# EasyEDA schematic SCH_EEPROM-Breakout-Board_2026-05-17.json
TITLE: EEPROM Breakout board; REV: 1.0; Date: 2025-09-20; Sheet: 1/1; Drawn By: srivatsarupadhya; Company: Your Company
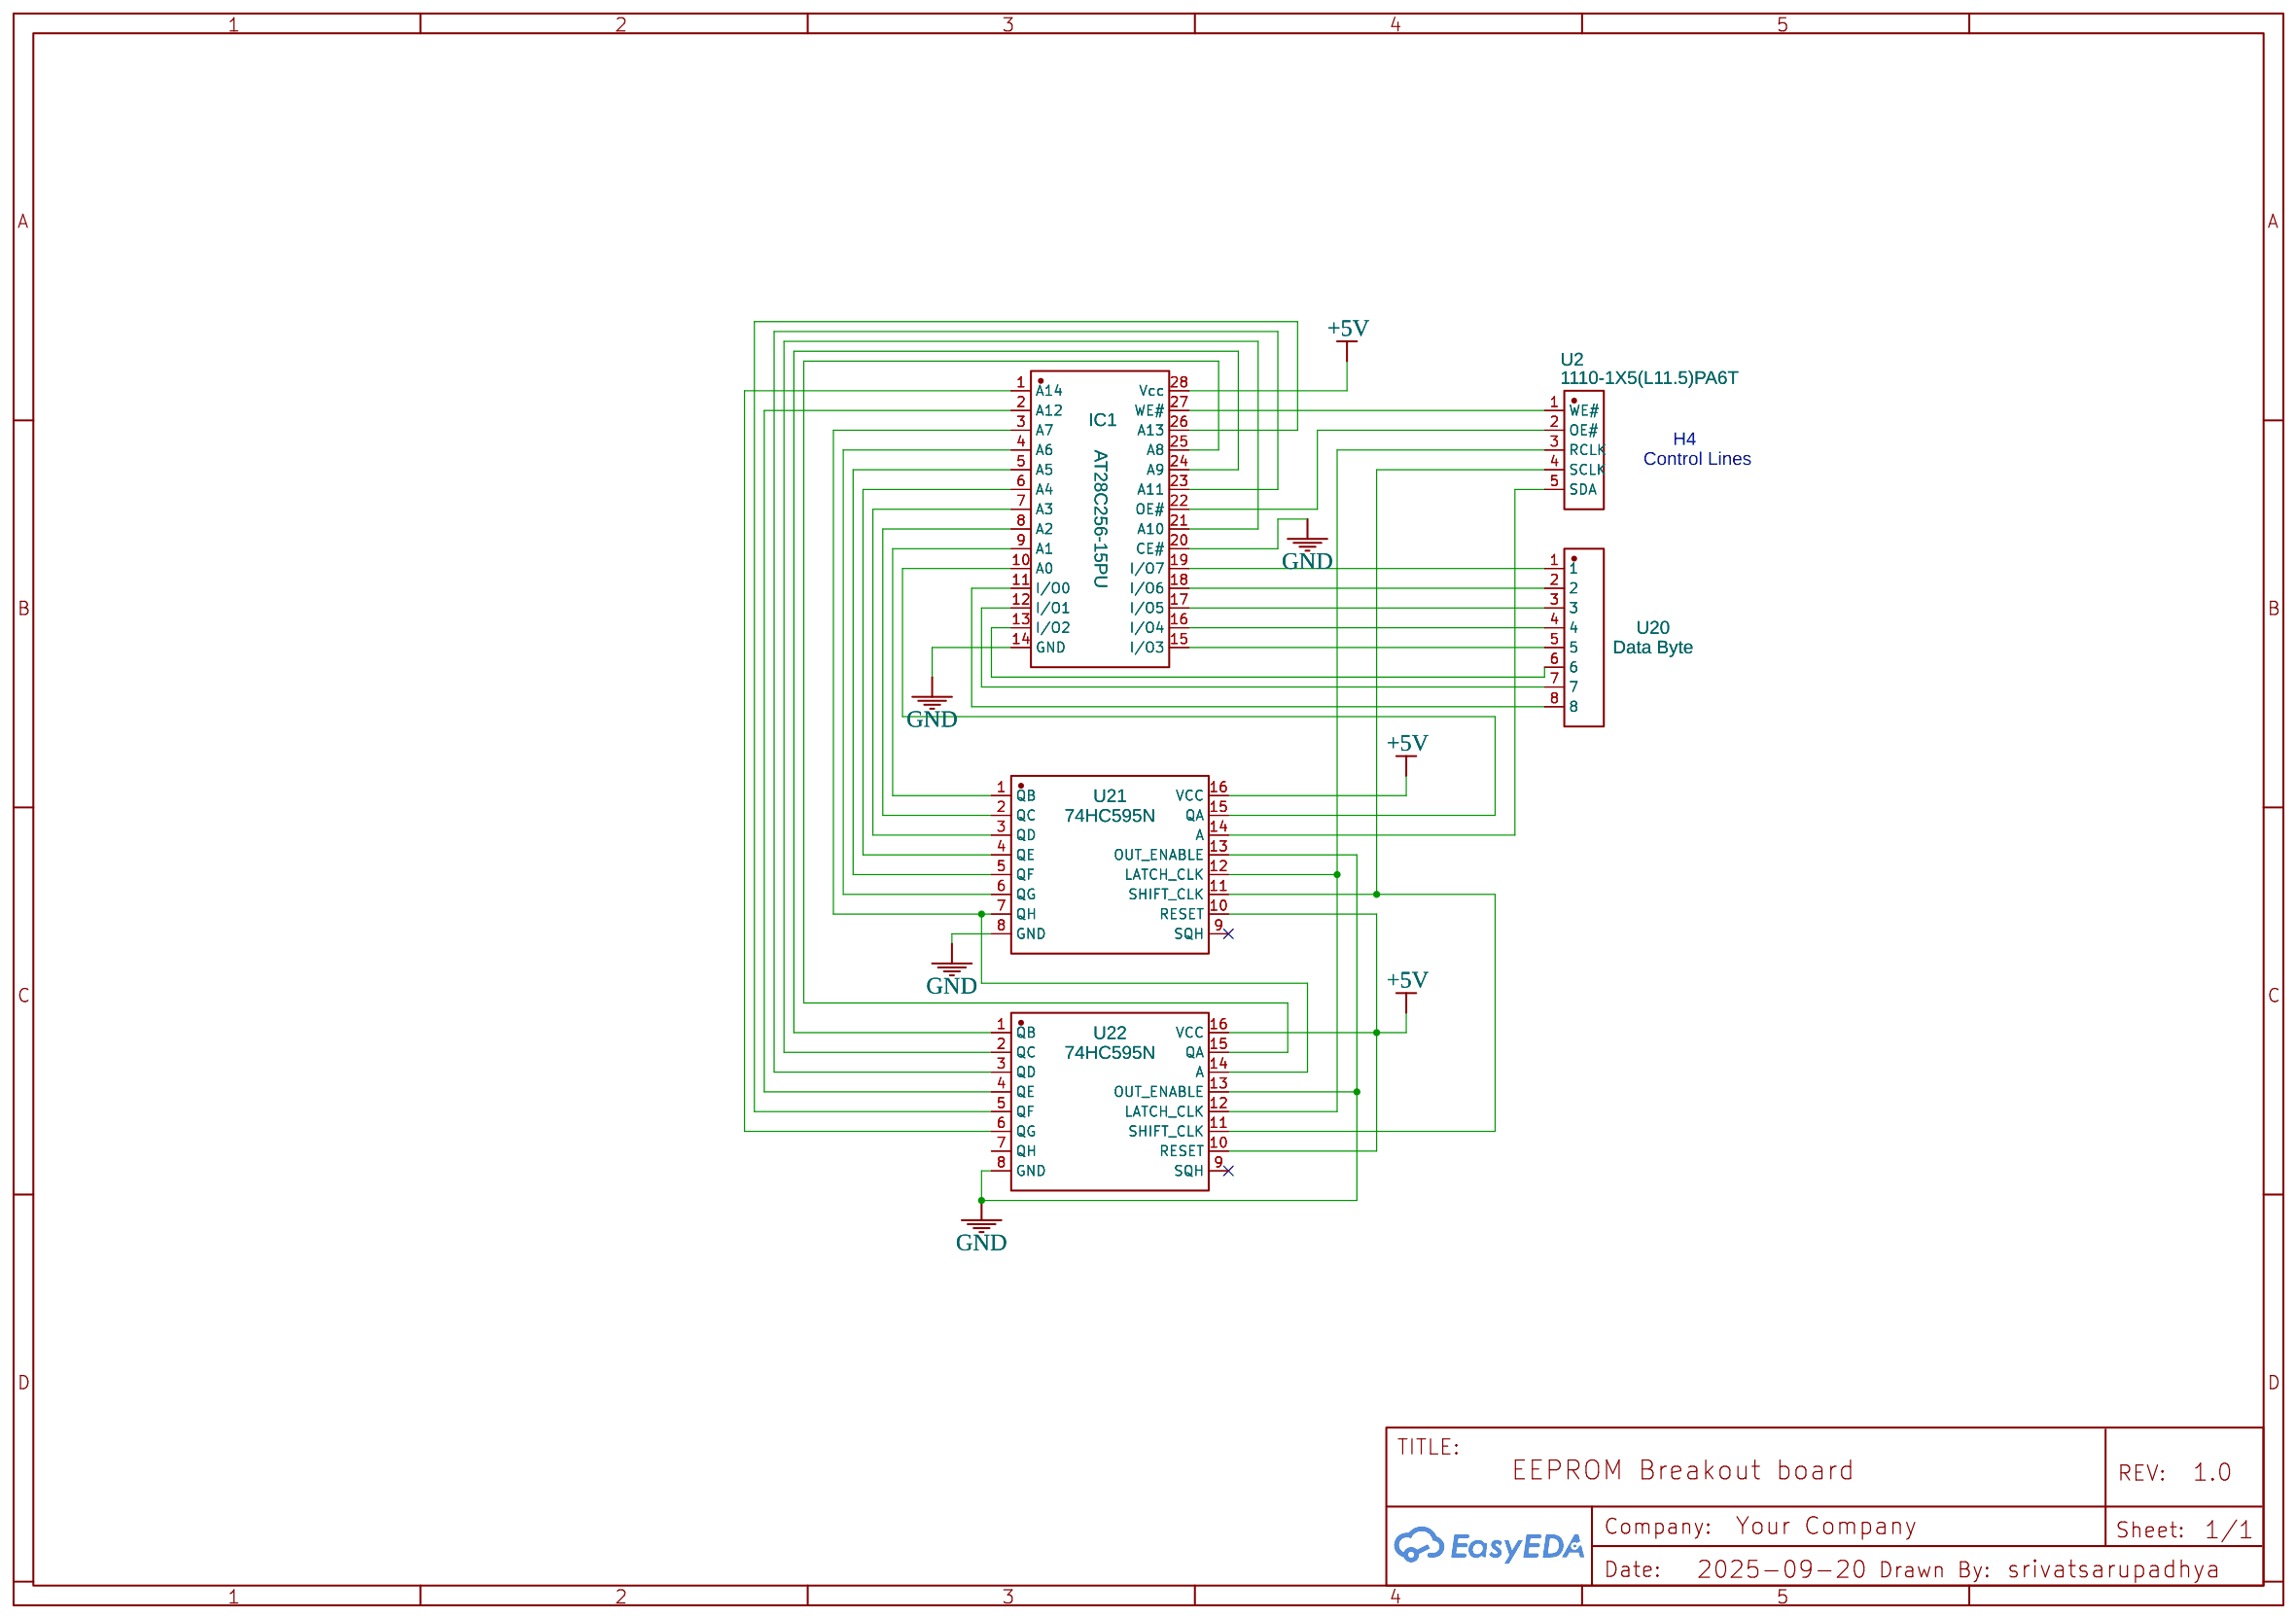
[diagram p0: schematic sheet]

## Parts
IC1  AT28C256-15PU  [PDIP-28_L37.0-W13.5-P2.54-LS15.6-BL]
U2  1110-1X5(L11.5)PA6T  [HDR-TH_5P-P2.54-H-M-W8.0]
U20  Data Byte  [HDR-TH_8P-P2.54-V-M]
U21  74HC595N  [DIP-16_L19.8-W6.5-P2.54-LS7.6-BL]
U22  74HC595N  [DIP-16_L19.8-W6.5-P2.54-LS7.6-BL]

## Library data of the parts
IC1 = AT28C256-15PU: Contributor: LCSC; Supplier: LCSC; Supplier Part: C1348752; Manufacturer: MICROCHIP(美国微芯); JLCPCB Part Class: Extended Part
U2 = 1110-1X5(L11.5)PA6T: Supplier: LCSC; Supplier Part: C18214185; Manufacturer: CST(永丰盈); Manufacturer Part: 1110-1x5(L11.5)PA6T; Contributor: lcsc; JLCPCB Part Class: Extended Part
U20 = 2.54-1*8: Supplier: LCSC; Supplier Part: C5156616; Manufacturer: ZHOURI(洲日); JLCPCB Part Class: Extended Part; Contributor: lcsc
U21 U22 = 74HC595N_C669328: Contributor: LCSC; Supplier: LCSC; Supplier Part: C669328; Manufacturer: HTC; JLCPCB Part Class: Extended Part

## Nets
+5V: IC1.28(Vcc) U21.10(RESET) U21.16(VCC) U22.10(RESET) U22.16(VCC)
GND: IC1.14(GND) IC1.20(CE#) U21.8(GND) U21.13(OUT_ENABLE) U22.8(GND) U22.13(OUT_ENABLE)
Net-(IC1-1): IC1.1(A14) U22.6(QG)
Net-(IC1-2): IC1.2(A12) U22.4(QE)
Net-(IC1-3): IC1.3(A7) U21.7(QH) U22.14(A)
Net-(IC1-4): IC1.4(A6) U21.6(QG)
Net-(IC1-5): IC1.5(A5) U21.5(QF)
Net-(IC1-6): IC1.6(A4) U21.4(QE)
Net-(IC1-7): IC1.7(A3) U21.3(QD)
Net-(IC1-8): IC1.8(A2) U21.2(QC)
Net-(IC1-9): IC1.9(A1) U21.1(QB)
Net-(IC1-10): IC1.10(A0) U21.15(QA)
Net-(IC1-11): IC1.11(I/O0) U20.8
Net-(IC1-12): IC1.12(I/O1) U20.7
Net-(IC1-13): IC1.13(I/O2) U20.6
Net-(IC1-15): IC1.15(I/O3) U20.5
Net-(IC1-16): IC1.16(I/O4) U20.4
Net-(IC1-17): IC1.17(I/O5) U20.3
Net-(IC1-18): IC1.18(I/O6) U20.2
Net-(IC1-19): IC1.19(I/O7) U20.1
Net-(IC1-21): IC1.21(A10) U22.2(QC)
Net-(IC1-22): IC1.22(OE#) U2.2(OE#)
Net-(IC1-23): IC1.23(A11) U22.3(QD)
Net-(IC1-24): IC1.24(A9) U22.1(QB)
Net-(IC1-25): IC1.25(A8) U22.15(QA)
Net-(IC1-26): IC1.26(A13) U22.5(QF)
Net-(IC1-27): IC1.27(WE#) U2.1(WE#)
Net-(U2-3): U2.3(RCLK) U21.12(LATCH_CLK) U22.12(LATCH_CLK)
Net-(U2-4): U2.4(SCLK) U21.11(SHIFT_CLK) U22.11(SHIFT_CLK)
Net-(U2-5): U2.5(SDA) U21.14(A)

Not connected (* = marked no-connect by the designer): U21 9(SQH)*; U22 7(QH) 9(SQH)*

## Notes on the sheet
- H4
- Control Lines
